# EAGLE design multi-pcb-power.v1 (EAGLE 9.6.2)
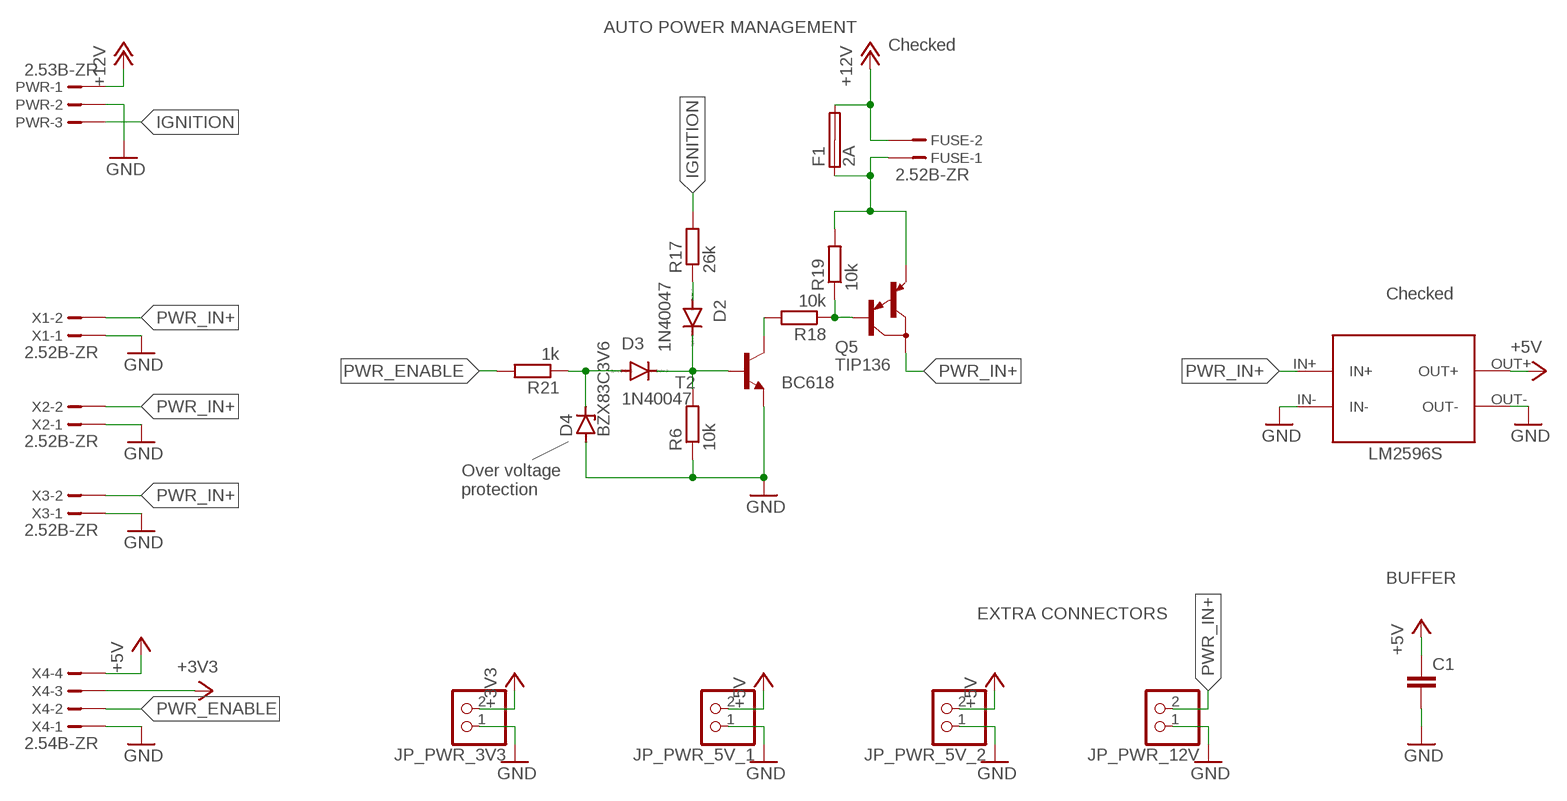
[diagram p0: schematic, sheet 1]

## Parts
C1  C-EU050-075X075  [C050-075X075]
D2  1N40047  [DO41-7.6]
D3  1N40047  [DO41-7.6]
D4  BZX83C3V6  BZX857  [DO41Z7.6]
F1  2A  SHK20L  [SHK20L]
FUSE  2.52B-ZR  [B2B-ZR2.5]
JP_PWR_3V3  PINHD-1X2  [1X02]
JP_PWR_5V_1  PINHD-1X2  [1X02]
JP_PWR_5V_2  PINHD-1X2  [1X02]
JP_PWR_12V  PINHD-1X2  [1X02]
PWR  2.53B-ZR  [B3B-ZR2.5]
Q5  TIP136  [TO220]
R6  10k  R-EU_0207/7  [0207/7]
R17  26k  R-EU_0207/10  [0207/10]
R18  10k  R-EU_0207/10  [0207/10]
R19  10k  R-EU_0207/10  [0207/10]
R21  1k  R-EU_0207/10  [0207/10]
T2  BC618  [TO92-EBC]
U$4  LM2596S  [LM2596S]
X1  2.52B-ZR  [B2B-ZR2.5]
X2  2.52B-ZR  [B2B-ZR2.5]
X3  2.52B-ZR  [B2B-ZR2.5]
X4  2.54B-ZR  [B4B-ZR2.5]

## Nets
+3V3: JP_PWR_3V3.2 X4.3
+5V: C1.1 JP_PWR_5V_1.2 JP_PWR_5V_2.2 U$4.OUT+ X4.4
+12V: F1.2A FUSE.2 PWR.1
GND: C1.2 D4.A JP_PWR_3V3.1 JP_PWR_5V_1.1 JP_PWR_5V_2.1 JP_PWR_12V.1 PWR.2 R6.1 T2.E U$4.IN- U$4.OUT- X1.1 X2.1 X3.1 X4.1
IGNITION: PWR.3 R17.2
N$5: D2.C D3.C R6.2 T2.B
N$11: D3.A D4.C R21.1
N$12: D2.A R17.1
N$14: Q5.1(B) R18.1 R19.1
N$15: R18.2 T2.C
N$21: F1.1A FUSE.1 Q5.3(E) R19.2
PWR_ENABLE: R21.2 X4.2
PWR_IN+: JP_PWR_12V.2 Q5.2(C) U$4.IN+ X1.2 X2.2 X3.2
Unconnected: F1.1B F1.2B

## Notes on the sheet
- AUTO POWER MANAGEMENT
- Checked
- Checked
- Over voltage
  protection
- BUFFER
- EXTRA CONNECTORS

## Library data of the parts
C1 = rcl:C-EU: CAPACITOR, European symbol; SPICEPREFIX: C
D2 D3 = diode-custom:1N4004: DIODE general purpose rectifier, 1 A
D4 = diode-custom:BZX85: Z DIODE
F1 = fuse:SHK20L: FUSE HOLDER 5 x 20 mm, SH contact, SHH1 Schukat, E1073 Buerklin; OC_FARNELL: unknown; OC_NEWARK: unknown
FUSE X1-X3 = con-jst-custom:?2B-ZR: ZH CONNECTOR 1.5 mm, 4 pin 1 row Source: http://www.jst.com .. eZH.pdf
JP_PWR_3V3 JP_PWR_5V_1 JP_PWR_5V_2 JP_PWR_12V = pinhead:PINHD-1X2: PIN HEADER
PWR = con-jst-custom:?3B-ZR: ZH CONNECTOR 1.5 mm, 4 pin 1 row Source: http://www.jst.com .. eZH.pdf
Q5 = transistor-pnp:TIP136: PNP Darlington Transistor
R6 R17-R19 R21 = rcl:R-EU_: RESISTOR, European symbol; SPICEPREFIX: R
T2 = transistor-npn:BC618*: NPN Transistor
U$4 = samuel:LM2596S
X4 = con-jst-custom:?4B-ZR: ZH CONNECTOR 1.5 mm, 4 pin 1 row Source: http://www.jst.com .. eZH.pdf

## Board
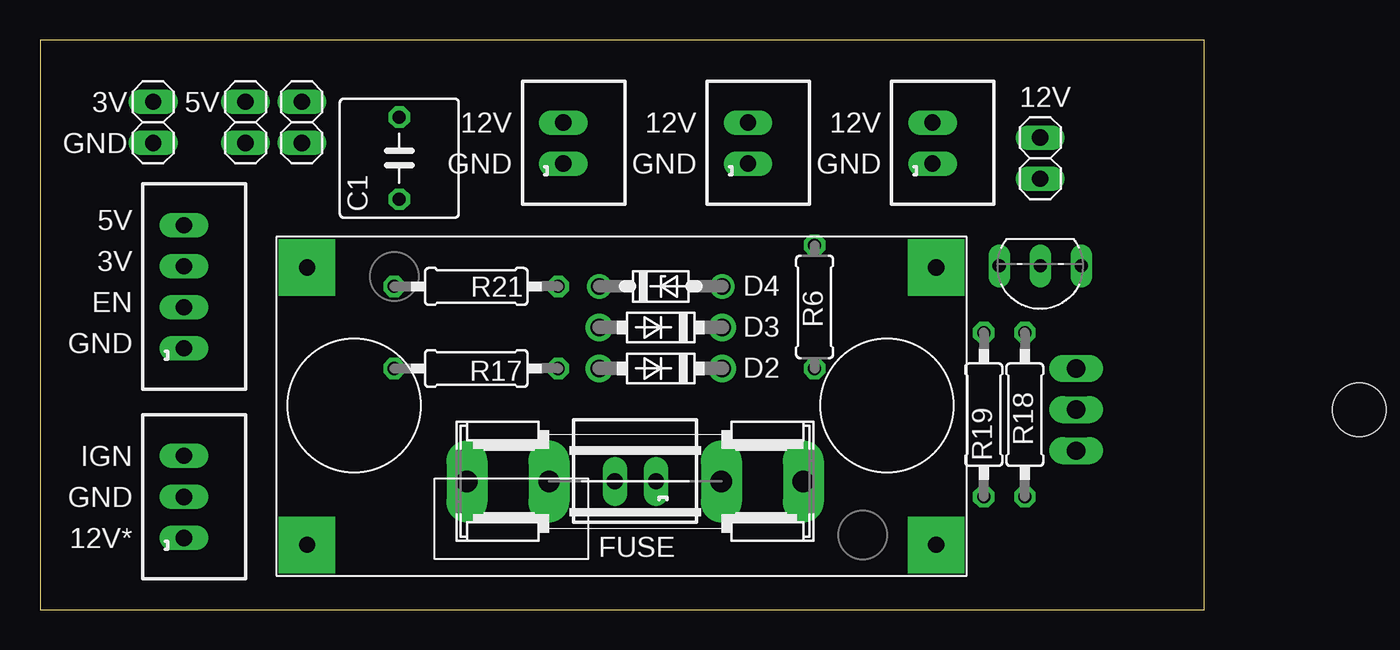
[diagram p1: board, top side]
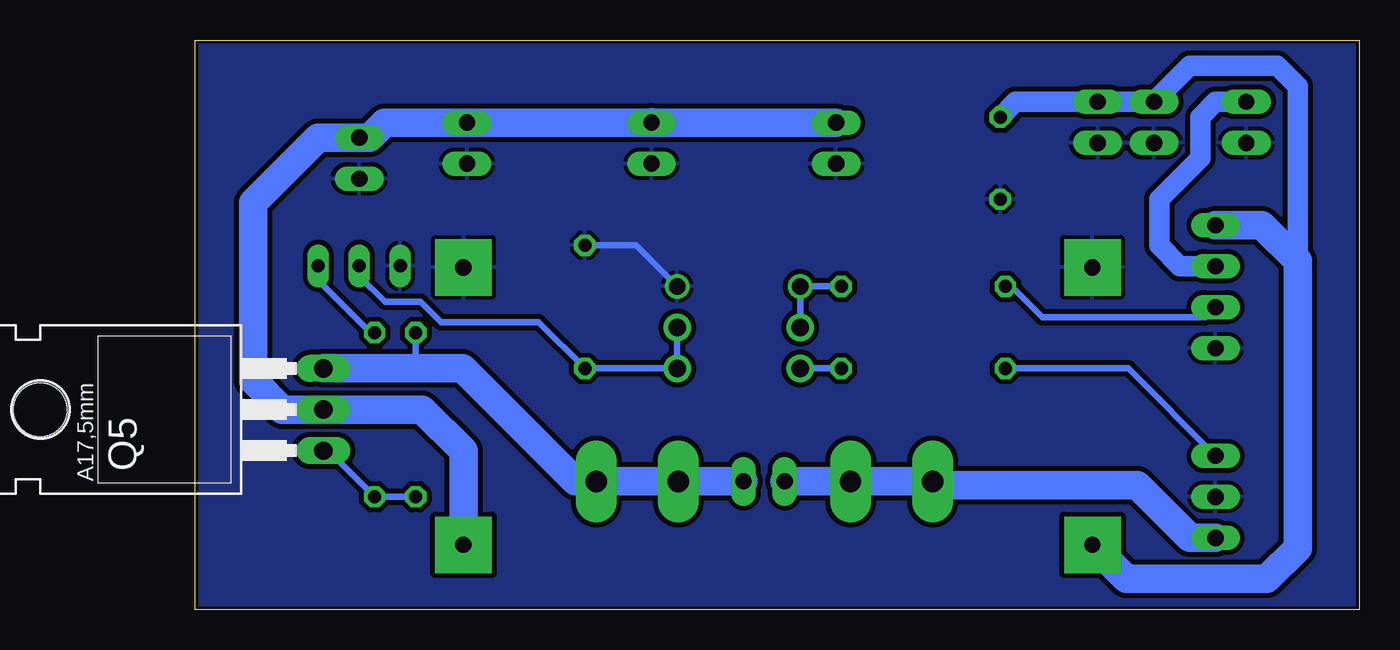
[diagram p2: board, bottom side, seen from below]

Size 72.06 x 35.23 mm. Coordinates in mm from the lower left corner, seen from the top.
Outline: 0,0 72.06,0 72.06,35.23 0,35.23 0,0
Copper layers (1*16): Top 0.035mm / dielectric 1.5mm / Bottom 0.035mm
Design rules "home-made-pcb": minimum track width 8mil, minimum drill 0.3mm, track to track 12mil, track to pad 8mil, pad to pad 10mil, via to via 10mil, smd to smd 6mil, copper to edge 8mil, drill to drill 10mil, minimum pad ring 10mil, minimum via ring 20mil, stop-mask expansion 4mil, vias tented up to drill 0mil, thermal gap 10mil

### Footprints (pad centres in the part's own frame; a part is rotated, then mirrored left to right if it is on the bottom)
C050-075X075 = drill 0.813 octagon: 1 -2.54,0; 2 2.54,0
DO41-7.6 = drill 1.1 pad 1.7: A 3.81,0; C -3.81,0
DO41Z7.6 = drill 1: A 3.81,0; C -3.81,0
SHK20L = drill 1.321 pad 2.54 long: 1A -10.414,0; 1B -5.334,0; 2A 10.414,0; 2B 5.334,0
B2B-ZR2.5 = drill 1 pad 1.422 long: 1 -1.285,0; 2 1.257,0
1X02 = drill 1.016 long: 1 -1.27,0; 2 1.27,0
B3B-ZR2.5 = drill 1 pad 1.422 long: 1 -2.555,0; 2 -0.013,0; 3 2.527,0
TO220 = drill 1.118 long: 1 -2.54,-6.35; 2 0,-6.35; 3 2.54,-6.35 | hole 3.302: 0,11.176
0207/7 = drill 0.813 octagon: 1 -3.81,0; 2 3.81,0
0207/10 = drill 0.813 octagon: 1 -5.08,0; 2 5.08,0
TO92-EBC = drill 0.813 long: B 0,-1.27; C -2.54,-1.27; E 2.54,-1.27
LM2596S = drill 1 pad 3.5 square: IN+ -19.633,8.963; IN- -19.633,-8.213; OUT+ 19.323,8.963; OUT- 19.323,-8.213
B4B-ZR2.5 = drill 1 pad 1.422 long: 1 -3.825,0; 2 -1.283,0; 3 1.257,0; 4 3.797,0

### Placement (x,y rotation side)
C1  22.23,27.94 270 top
D2  38.42,14.92 180 top
D3  38.42,17.46 180 top
D4  38.42,20 0 top
F1  36.83,7.94 180 top
FUSE  36.83,7.94 180 top
JP_PWR_3V3  6.99,30.16 90 top
JP_PWR_5V_1  16.19,30.16 90 top
JP_PWR_5V_2  12.7,30.16 90 top
JP_PWR_12V  61.91,27.94 90 top
PWR  8.89,6.99 90 top
Q5  70.48,12.38 90 bottom
R6  47.94,18.73 270 top
R17  26.99,14.92 180 top
R18  60.96,12.06 90 top
R19  58.42,12.06 90 top
R21  26.99,20 180 top
T2  61.91,20 180 top
U$4  35.83,12.96 180 top
X1  55.24,28.89 90 top
X2  32.38,28.89 90 top
X3  43.81,28.89 90 top
X4  8.89,20 90 top

### Tracks (layer width: path | path; a pad name or v marks a point on that pad's centre or on a via)
+3V3
  Bottom 1.27: X4.3 11.1,21.26 12.38,22.54 12.38,25.4 9.84,27.94 9.84,30.48 8.89,31.43 JP_PWR_3V3.2
+5V
  Bottom 1.27: C1.1 21.27,31.43 JP_PWR_5V_1.2 JP_PWR_5V_2.2 10.48,33.66 5.08,33.66 3.81,32.38 3.81,21.59
  Bottom 1.778: U$4.OUT+ 14.41,1.91 5.71,1.91 3.81,3.81 3.81,21.59 6.02,23.8 X4.4
+12V
  Bottom 1.778: PWR.1 10.48,4.43 13.75,7.7 26.18,7.7 F1.2A FUSE.2
GND
  Bottom 0.406: D4.A 44.77,22.54 R6.1
  pour Bottom: -0.64,43.81 -0.64,-0.64 81.92,-0.64 81.92,43.81
IGNITION
  Bottom 0.406: PWR.3 14.3,14.92 R17.2
N$5
  Bottom 0.406: D3.C D2.C R6.2 50.8,17.78 56.83,17.78 58.1,19.05 60.33,19.05 61.91,20.64 T2.B
N$11
  Bottom 0.406: R21.1 D4.C D3.A
N$12
  Bottom 0.406: R17.1 D2.A
N$14
  Bottom 0.406: R19.1 R18.1 63.82,9.84 Q5.1
N$15
  Bottom 0.406: R18.2 61.22,17.14 64.45,20.37 T2.C
N$21
  Bottom 0.406: R19.2 58.42,14.92
  Bottom 1.778: FUSE.1 F1.1A 48.52,7.94 55.5,14.92 58.42,14.92 Q5.3
PWR_ENABLE
  Bottom 0.406: R21.2 21.52,20 19.6,18.08 9.53,18.08 X4.2
PWR_IN+
  Bottom 1.778: X2.2 X3.2 43.81,30.16 43.83,30.15 X1.2 60.34,30.15 61.28,29.21 JP_PWR_12V.2 64.45,29.21 68.49,25.17 68.49,14.2 66.67,12.38 Q5.2 58.03,12.38 55.47,9.82 U$4.IN+

### Text on the board
tNames: 3V | 5V | 12V | 12V | 12V | 12V | GND | GND | GND | GND | 5V | 3V | EN | GND | IGN | GND | 12V*